# Altium schematic sheet epd.SchDoc
size A; SheetNumber: 3; SheetTotal: 3
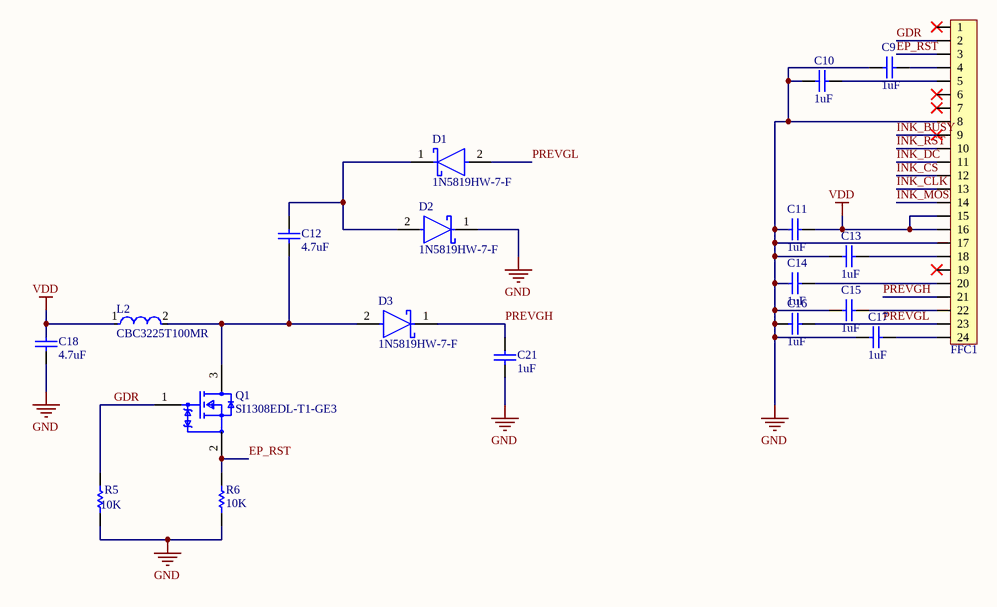
[diagram p0: epd.SchDoc]

## Parts
C9  value 1uF  [C0402]  (hidden comment: MCD-00095)
C10  value 1uF  [C0402]  (hidden comment: MCD-00095)
C11  value 1uF  [C0402]  (hidden comment: MCD-00095)
C12  value 4.7uF  [C0402]  (hidden comment: Capacitor)
C13  value 1uF  [C0402]  (hidden comment: MCD-00095)
C14  value 1uF  [C0402]  (hidden comment: MCD-00095)
C15  value 1uF  [C0402]  (hidden comment: MCD-00095)
C16  value 1uF  [C0402]  (hidden comment: MCD-00095)
C17  value 1uF  [C0402]  (hidden comment: MCD-00095)
C18  value 4.7uF  [C0402]  (hidden comment: Capacitor)
C21  value 1uF  [C0402]  (hidden comment: MCD-00095)
D1  1N5819HW-7-F  [FP-SOD123-IPC_A]
D2  1N5819HW-7-F  [FP-SOD123-IPC_A]
D3  1N5819HW-7-F  [FP-SOD123-IPC_A]
FFC1  FFC_0.5_24  [FFC_0.5_24_INK]  (value not drawn)
L2  CBC3225T100MR  [FP-CB3225-IPC_A]
Q1  SI1308EDL-T1-GE3  [FP-5549-MFG]
R5  value 10K  [R0402]  (hidden comment: Resistor)
R6  value 10K  [R0402]  (hidden comment: Resistor)

## Nets
GND: C9.1 C10.1 C11.1 C13.1 C14.1 C15.1 C16.1 C17.1 C18.1 C21.1 D2.1(C) FFC1.8 FFC1.17 R5.1 R6.1
VDD: C11.2 C18.2 FFC1.15 FFC1.16 L2.1
EP_RST: FFC1.3 Q1.2(S) R6.2
GDR: FFC1.2 Q1.1(G) R5.2
INK_BUSY: FFC1.9
INK_CLK: FFC1.13
INK_CS: FFC1.12
INK_DC: FFC1.11
INK_MOSI: FFC1.14
INK_RST: FFC1.10
PREVGH: C21.2 D3.1(C) FFC1.21
PREVGL: C16.2 D1.2(A) FFC1.23
NetC9_2: C9.2 FFC1.4
NetC10_2: C10.2 FFC1.5
NetC12_1: C12.1 D3.2(A) L2.2 Q1.3(D)
NetC12_2: C12.2 D1.1(C) D2.2(A)
NetC13_2: C13.2 FFC1.18
NetC14_2: C14.2 FFC1.20
NetC15_2: C15.2 FFC1.22
NetC17_2: C17.2 FFC1.24

Not connected (* = marked no-connect by the designer): FFC1 1* 6* 7* 19*

## Library data of the parts
C9-C11 C13-C17 C21 = MCD-00095: Capacitor,1uF,6V3,X5R,10%,0402; Manufacturer_Part_Number: GRM155R61E105KA12; Manufacturer: MURATA; Alternate_Manufacturer_Part_Number: GRM155R60J105KE19; ECCN_US: EAR99; ECCN_EU: NEC; Provided_By: SUBCO; Initial_Board_Reference: MB1262; Internal_Part_Number: MCD-00095; Status: Released; Part_Type: Capacitor; Package: C0402; ComponentLink1Description: Datasheet; ComponentLink1URL: http://tunmcdsvn.tun.st.com/Component_Datasheet_Library/Trunk/Capacitors/Murata_Capacitor_GR_series; Alternate_Manufacturer: MURATA
C12 C18 = MCD-01356: Capacitor, MLCC, 4.7uF, 6V3, X5R, 20%, 0402, T=0,5mm; Manufacturer_Part_Number: GRM155R60J475ME47; Manufacturer: MURATA; Provided_By: SUBCO; Internal_Part_Number: MCD-01356; Status: Released; Part_Type: Capacitor; Package: C0402; ComponentLink1Description: Datasheet; ComponentLink1URL: http://tunmcdsvn.tun.st.com/Component_Datasheet_Library/Trunk/Capacitors/Murata_Capacitor_GR_series
D1-D3 = CMP-0303-00003-3: DIODE SCHOTTKY 40V 1A SOD123; Forward Voltage: 450mV; Capacitance: 110pF; Max Forward Surge Current (Ifsm): 25A; Peak Reverse Current: 50uA; Polarity: Standard; Element Configuration: Single; Max Power Dissipation: 450mW; Min Operating Temperature: -65°C; Package Quantity: 3000; Contact Plating: Tin; Weight: 0.000353oz; Max Repetitive Reverse Voltage (Vrrm): 40V; Max Reverse Voltage (DC): 40V; Height: 1.25mm; Average Rectified Current: 1A; Width: 1.7mm; Case/Package: SOD-123-2; Lead Free: Lead Free; Max Operating Temperature: 125°C; Current Rating: 1A; Termination: SMD/SMT; Forward Current: 1A; Radiation Hardening: No; Number of Pins: 2; Length: 2.85mm; Voltage Rating (DC): 40V; REACH SVHC: No SVHC; Peak Non-Repetitive Surge Current: 25A; Packaging: Tape and Reel; Output Current: 1A
FFC1 = FFC_0.5_24_INK: FFC
L2 = CMP-14484-000123-1: SMD Inductors 10uH ±20% 0.9A 0.1729Ω 1210; Shielding: Unshielded; DC Resistance (DCR): 172.9mR; Core Material: Ferrite; Self Resonant Frequency: 23MHz; Max DC Current: 900mA; Test Frequency: 100kHz; Package Quantity: 1000; Military Standard: Not; Inductance: 10uH; Height: 2.5mm; Case Code (Metric): 3225; Width: 0.098inch; Case Code (Imperial): 1210; Inductance Tolerance: 20%; Lead Free: Lead Free; Length: 3.4mm; Max Operating Temperature: 105°C; Resistor Type: Wirewound; Height - Seated (Max): 0.106inch; Series: CB; Packaging: Tape and Reel; Depth: 2.7mm; Number of Pins: 2; Radiation Hardening: No; Tolerance: 20%; Case/Package: 1210; Mount: Surface Mount; Saturation Current: 900mA; Min Operating Temperature: -40°C; DC Current: 900mA; Current Rating: 900mA; Halogen Free: Halogen Free; Termination: SMD/SMT
Q1 = CMP-02550-000099-2: MOSFET N-CH 30V 1.4A SC-70-3; Fall Time: 8ns; Max Power Dissipation: 500mW; Rise Time: 9ns; Rds On Max: 132mR; Power Dissipation: 400mW; Polarity: N-CHANNEL; Number of Elements: 1; Element Configuration: Single; Threshold Voltage: 600mV; Continuous Drain Current (ID): 1.5A; Gate to Source Voltage (Vgs): 12V; Turn-On Delay Time: 2ns; Input Capacitance: 105pF; Package Quantity: 3000; REACH SVHC: No SVHC; Mount: Surface Mount; Packaging: Tape and Reel; On-State Resistance: 132mR; Drain-source On Resistance-Max: 132mR; Lead Free: Lead Free; Drain to Source Breakdown Voltage: 30V; Series: TrenchFET®; Max Operating Temperature: 150°C; Drain to Source Resistance: 132mR; Radiation Hardening: No; Length: 2.2mm; Min Operating Temperature: -55°C; Number of Channels: 1; Drain to Source Voltage (Vdss): 30V; Number of Pins: 3; Turn-Off Delay Time: 8ns; Weight: 0.004395oz; RoHS Compliant: Yes; Width: 1.35mm; Height: 1mm; Case/Package: SOT-323
R5 R6 = MCD-00053: Resistor,10K,0402,1%,1/16W; Manufacturer_Part_Number: RC0402FR-0710KL; Manufacturer: YAGEO; Provided_By: SUBCO; Initial_Board_Reference: MB1274; Internal_Part_Number: MCD-00053; ComponentLink1Description: Datasheet; ECCN_US: n/a; ECCN_EU: n/a; Status: Released; Part_Type: Resistor; ComponentLink1URL: http://tunmcdsvn.tun.st.com/Component_Datasheet_Library/Trunk/Resistors/Yageo_Resistor_RC0402-series; Package: R0402